# Altium schematic sheet IV_Converter.SchDoc
size A4
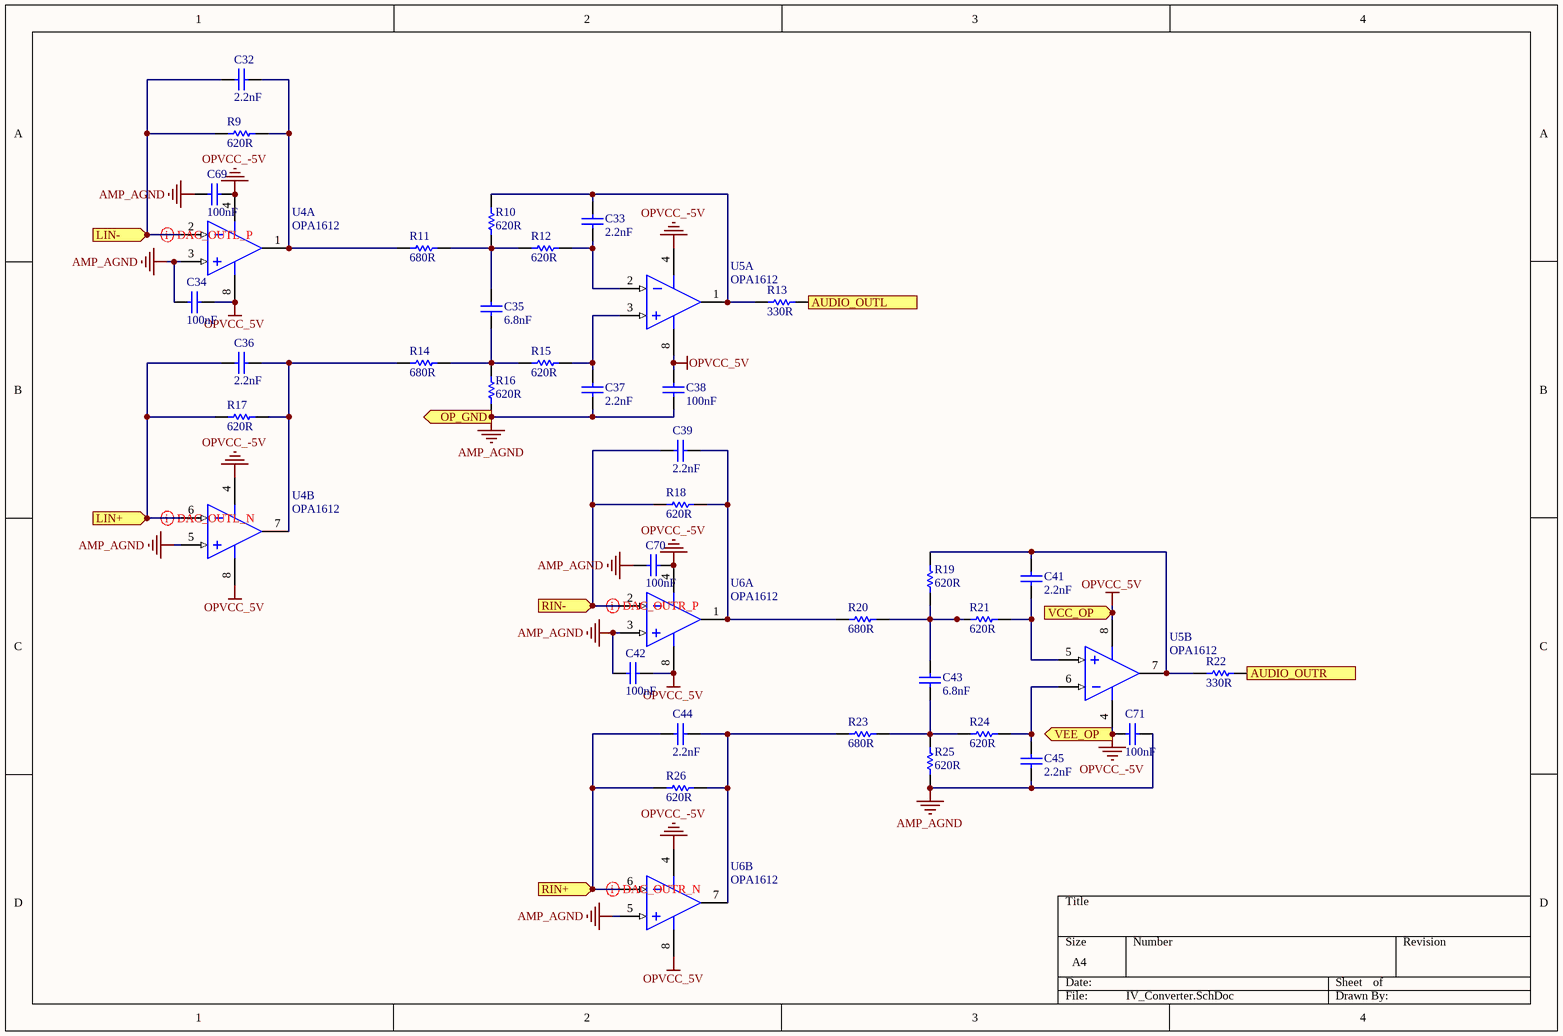
[diagram p0: IV_Converter.SchDoc]

## Parts
C32  2.2nF  [SMC_0805]
C33  2.2nF  [SMC_0805]
C34  100nF  [SMC_0402]
C35  6.8nF  [SMC_0805]
C36  2.2nF  [SMC_0805]
C37  2.2nF  [SMC_0805]
C38  100nF  [SMC_0402]
C39  2.2nF  [SMC_0805]
C41  2.2nF  [SMC_0805]
C42  100nF  [SMC_0402]
C43  6.8nF  [SMC_0805]
C44  2.2nF  [SMC_0805]
C45  2.2nF  [SMC_0805]
C69  100nF  [SMC_0402]
C70  100nF  [SMC_0402]
C71  100nF  [SMC_0402]
R9  620R  [SMR_0805]
R10  620R  [SMR_0805]
R11  680R  [SMR_0805]
R12  620R  [SMR_0805]
R13  330R  [SMR_0805]
R14  680R  [SMR_0805]
R15  620R  [SMR_0805]
R16  620R  [SMR_0805]
R17  620R  [SMR_0805]
R18  620R  [SMR_0805]
R19  620R  [SMR_0805]
R20  680R  [SMR_0805]
R21  620R  [SMR_0805]
R22  330R  [SMR_0805]
R23  680R  [SMR_0805]
R24  620R  [SMR_0805]
R25  620R  [SMR_0805]
R26  620R  [SMR_0805]
U4  OPA1612  [SOIC127P600X175-8N]  (parts A,B of 2)
U5  OPA1612  [SOIC127P600X175-8N]  (parts A,B of 2)
U6  OPA1612  [SOIC127P600X175-8N]  (parts A,B of 2)

## Ports
AUDIO_OUTL (out), AUDIO_OUTR (out), LIN+ (in), LIN- (in), OP_GND (out), RIN+ (in), RIN- (in), VCC_OP (in), VEE_OP (out)

## Nets
AMP_AGND: C34.1 C37.1 C38.1 C42.1 C45.1 C69.1 C70.1 C71.2 R16.1 R25.1 U4.3(IN+) U4.5(IN+) U6.3(IN+) U6.5(IN+) ; port OP_GND
OPVCC_5V: C34.2 C38.2 C42.2 U4.8(V+) U5.8(V+) U6.8(V+) ; port VCC_OP
OPVCC_-5V: C69.2 C70.2 C71.1 U4.4(V-) U5.4(V-) U6.4(V-) ; port VEE_OP
AUDIO_OUTL: R13.2 ; port AUDIO_OUTL
AUDIO_OUTR: R22.2 ; port AUDIO_OUTR
LIN+: C36.1 R17.1 U4.6(IN-) ; port LIN+
LIN-: C32.1 R9.1 U4.2(IN-) ; port LIN-
RIN+: C44.1 R26.1 U6.6(IN-) ; port RIN+
RIN-: C39.1 R18.1 U6.2(IN-) ; port RIN-
NetC32_2: C32.2 R9.2 R11.1 U4.1(OUT)
NetC33_1: C33.1 R12.1 U5.2(IN-)
NetC33_2: C33.2 R10.2 R13.1 U5.1(OUT)
NetC35_1: C35.1 R14.2 R15.2 R16.2
NetC35_2: C35.2 R10.1 R11.2 R12.2
NetC36_2: C36.2 R14.1 R17.2 U4.7(OUT)
NetC37_2: C37.2 R15.1 U5.3(IN+)
NetC39_2: C39.2 R18.2 R20.1 U6.1(OUT)
NetC41_1: C41.1 R21.1 U5.5(IN+)
NetC41_2: C41.2 R19.2 R22.1 U5.7(OUT)
NetC43_1: C43.1 R23.2 R24.2 R25.2
NetC43_2: C43.2 R19.1 R20.2 R21.2
NetC44_2: C44.2 R23.1 R26.2 U6.7(OUT)
NetC45_2: C45.2 R24.1 U5.6(IN-)

## Layout directives
differential pair: LIN+, LIN-, RIN+, RIN-

## Library data of the parts
C32-C39 C41-C45 C69-C71 = Cap Ceramic
R9-R26 = Res SMT
U4-U6 = LM358D